# EAGLE schematic XL4432-SMT (EAGLE 6.4)
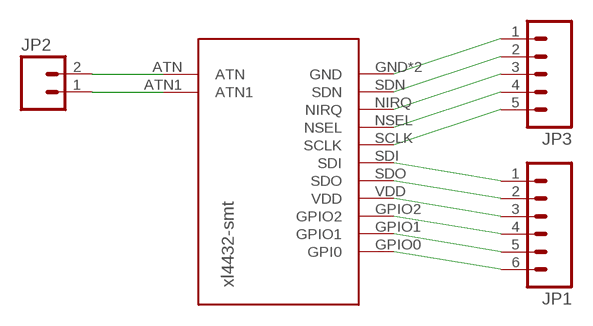
[diagram p0: schematic, sheet 1]

## Parts
JP1  M06LOCK  [1X06_LOCK]
JP2  M02LOCK  [1X02_LOCK]
JP3  M05LOCK  [1X05_LOCK]
U$1  XL4432-SMT  [XL4432-SMT]

## Nets
GND: JP3.1 U$1.GND U$1.GND1(GND)
GPIO0: JP1.6 U$1.GPIO0(GPI0)
GPIO1: JP1.5 U$1.GPIO1
GPIO2: JP1.4 U$1.GPIO2
N$12: JP2.2 U$1.ATN
N$13: JP2.1 U$1.ATN1
NIRQ: JP3.3 U$1.NIRQ
NSEL: JP3.4 U$1.NSEL
SDI: JP1.1 U$1.SDI
SDN: JP3.2 U$1.SDN
SDO: JP1.2 U$1.SDO
SLCK: JP3.5 U$1.SCLK
VDD: JP1.3 U$1.VDD

## Library data of the parts
JP1 = SparkFun:M06: Header 6 Standard 6-pin 0.1" header. Use with straight break away headers (SKU : PRT-00116), right angle break away headers (PRT-00553), swiss pins (PRT-00743), machine pins (PRT-00117), and female headers (PRT-00115). Molex polarized connector foot print use with SKU : PRT-08094 with associated crimp pins and housings. NOTES ON THE VARIANTS LOCK and LOCK_LONGPADS... This footprint was designed to help hold the alignment of a through-hole component (i.e. 6-pin header) while soldering it into place. You may notice that each hole has been shifted either up or down by 0.005 of an inch from it's more standard position (which is a perfectly straight line). This slight alteration caused the pins (the squares in the middle) to touch the edges of the holes. Because they are alternating, it causes a "brace" to hold the component in place. 0.005 has proven to be the perfect amount of "off-center" position when using our standard breakaway headers. Although looks a little odd when you look at the bare footprint, once you have a header in there, the alteration is very hard to notice. Also, if you push a header all the way into place, it is covered up entirely on the bottom side. This idea of altering the position of holes to aid alignment will be further integrated into the Sparkfun Library for other footprints. It can help hold any component with 3 or more connection pins.
JP2 = SparkFun:M02: Header 2 Standard 2-pin 0.1" header. Use with straight break away headers (SKU : PRT-00116), right angle break away headers (PRT-00553), swiss pins (PRT-00743), machine pins (PRT-00117), and female headers (PRT-00115). Molex polarized connector foot print use with SKU : PRT-08233 with associated crimp pins and housings.
JP3 = SparkFun:M05: Header 5 Standard 5-pin 0.1" header. Use with straight break away headers (SKU : PRT-00116), right angle break away headers (PRT-00553), swiss pins (PRT-00743), machine pins (PRT-00117), and female headers (PRT-00115). Molex polarized connector foot print use with SKU : PRT-08230 with associated crimp pins and housings.
U$1 = Random parts:XL4432-SMT